# EasyEDA Pro project functional hub.epro, board PCB1
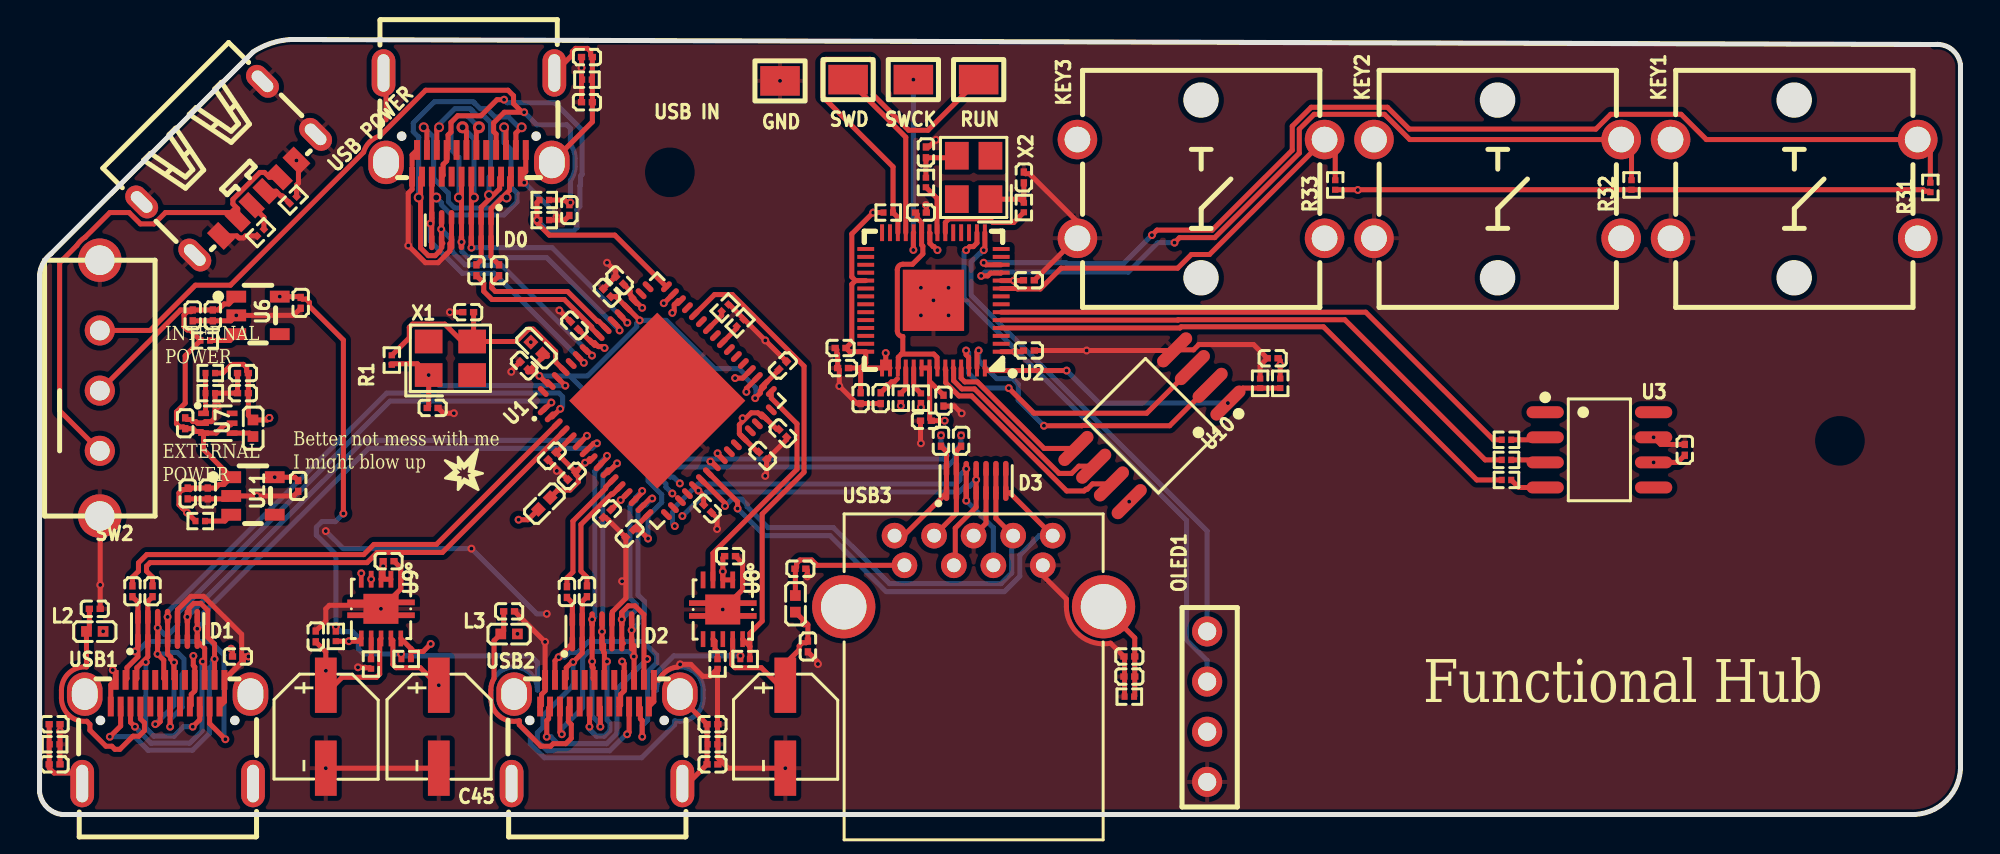
[diagram p1: board, top side]
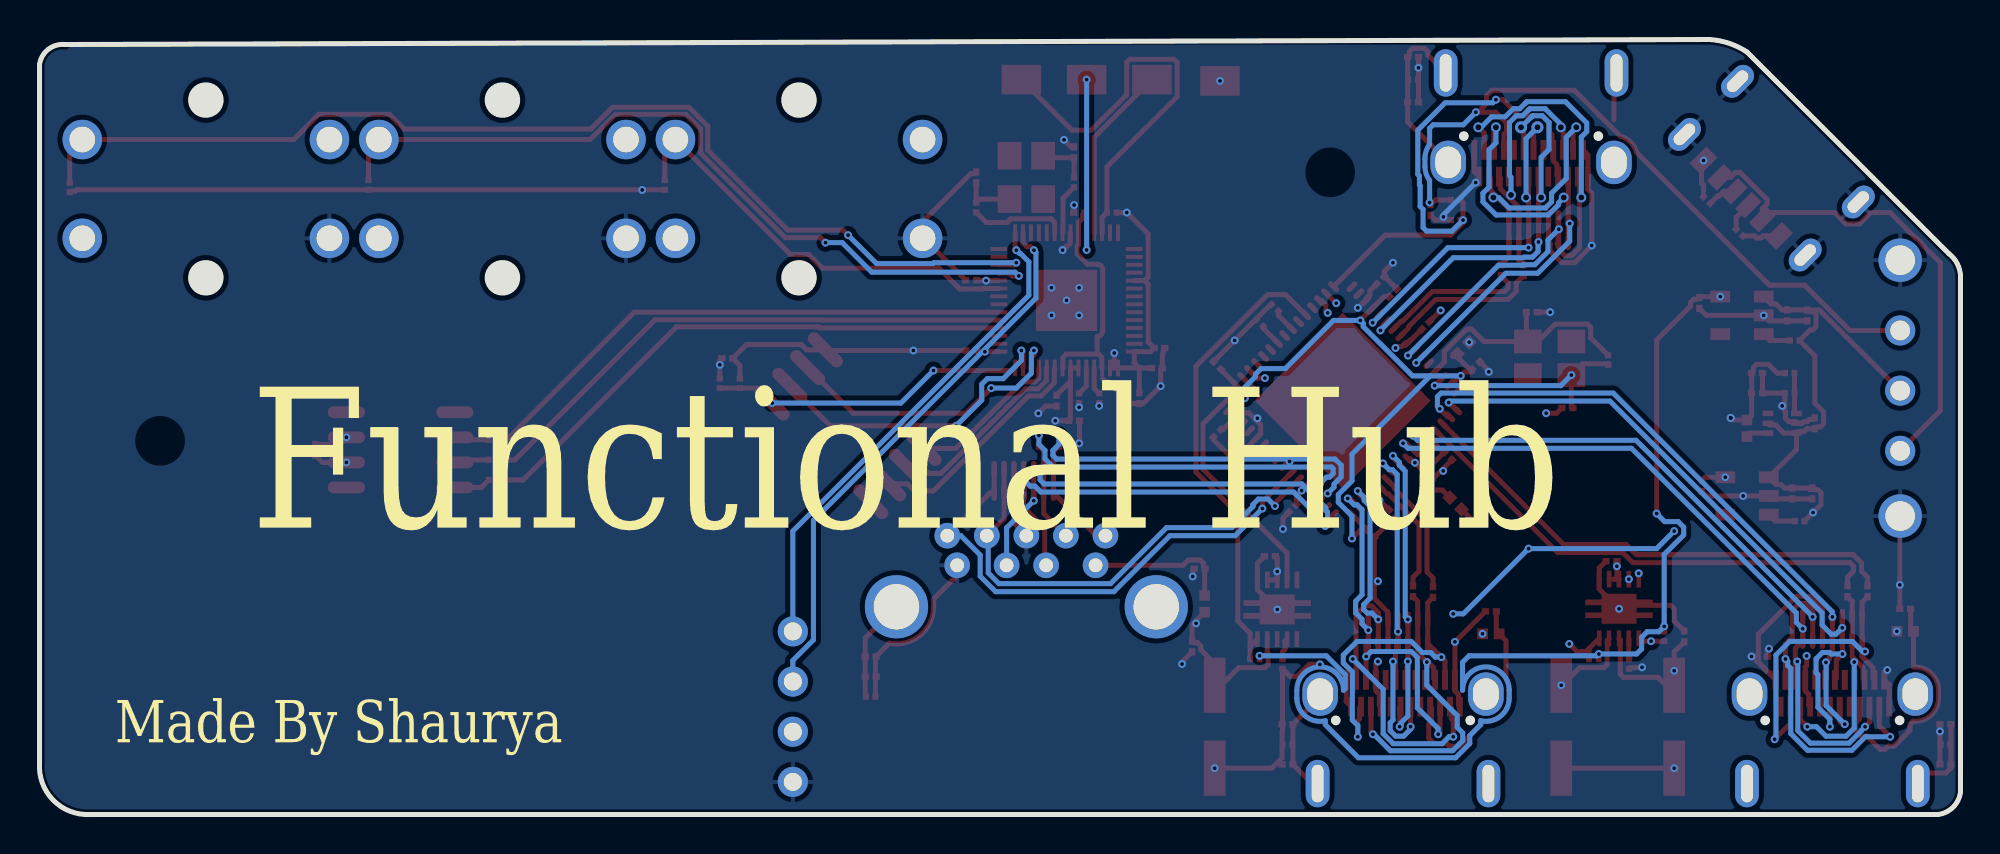
[diagram p2: board, bottom side, seen from below]

Outline 97.15 x 39.24 mm; copper layers: Top Layer, Inner1, Inner2, Bottom Layer. Coordinates in mm from the lower left corner of the outline.
Outline path: 0,27.3 0,1.14 arc(0.37,0.37) 1.14,0 94.61,0 arc(96.46,0.73) 97.15,2.59 97.15,37.97 arc(96.71,38.74) 95.86,38.99 12.7,39.24 arc(11.71,39.05) 10.8,38.61 0.57,28.39 arc(0.17,27.91) 0,27.3
Stack: Top Layer 0.035mm Outer layer thickness 1oz / Dielectric1 0.2104mm 7628 RC49% 8.6mil / Inner1 0.0152mm Inner layer thickness / Dielectric2 1.065mm 1.1mm H/HOZ Copper / Inner2 0.0152mm Inner layer thickness / Dielectric3 0.2104mm 7628 RC49% 8.6mil / Bottom Layer 0.035mm Outer layer thickness 1oz

## Design rules (mm)
net TX0+: DP6
net T0+: DP1
net TX0-: DP6
net T0-: DP1
net TX1+: DP4
net TX1-: DP4
net TX2+: DP5
net TX2-: DP5
net TX3-: DP11
net TX3+: DP11
net D0+: DP2
net D0-: DP2
net RX0+: DP3
net RX0-: DP3
net D1+: DP7
net D1-: DP7
net RX1+: DP8
net RX1-: DP8
net D2+: DP9
net D2-: DP9
net RX2+: DP10
net RX2-: DP10
net D3+: DP12
net D3-: DP12
net RX3+: DP13
net RX3-: DP13
net PI_DP: DP14
net PI_DM: DP14
spacing copperThickness1oz (default): track to track 0.102, other pairs 0.152 to 0.3
spacing copperThickness2oz: track to track 0.203, other pairs 0.152 to 0.3
spacing Plane_innerPlane: track to track 0.102, other pairs 0.152 to 0.3
spacing Copper_copperRegion: track to track 0.102, other pairs 0.152 to 0.3
track width copperThickness1oz (default): min 0.127, default 0.254, max 2.54
track width copperThickness2oz: min 0.203, default 0.254, max 2.54
differential pair differentialPair (default): width min 0.127, default 0.254, max 2.54; gap min 0.152, default 0.152
net GND uses copperRegion_copperThickness1oz
net VBUS1 uses copperRegion_copperThickness1oz
net VBUS2 uses copperRegion_copperThickness1oz
net VBUS3 uses copperRegion_copperThickness1oz
pour e1772 uses Copper_copperRegion, copperRegion_Copper_copperRegion
pour e2090 uses Copper_copperRegion, copperRegion_Copper_copperRegion
pour e2312 uses Copper_copperRegion, copperRegion_Copper_copperRegion
pour e2453 uses Copper_copperRegion, copperRegion_Copper_copperRegion

## Placement (name value [footprint] x y rotation side)
C1  18pf  [C0201]  19.88 20.59 0 top
C2  18pf  [C0201]  21.68 25.44 0 top
C8  0.001uf  [C0201]  34.04 2.54 180 top
C9  0.1uf  [C0201]  34.04 4.57 0 top
C10  0.1uf  [C0201]  26.67 11.26 90 top
C11  0.1uf  [C0201]  27.69 11.3 90 top
C12  0.1uf  [C0201]  23.75 10.29 0 top
C13  0.001uf  [C0201]  27.69 38.35 0 top
C14  0.1uf  [C0201]  27.69 36.07 180 top
C15  0.1uf  [C0201]  23.24 27.56 270 top
C16  0.1uf  [C0201]  22.1 27.56 270 top
C17  100nF  [C0201]  26.8 30.61 270 top
C18  0.1uf  [C0201]  46.61 18.92 90 top
C19  0.1uf  [C0201]  45.59 18.92 90 top
C20  0.001uf  [C0201]  55.12 8 0 top
C21  0.1uf  [C0201]  55.12 6.98 180 top
C22  4.7uf  [C0201]  7.37 19.81 270 top
C23  22uf  [C0201]  10.29 22.35 0 top
C24  22uf  [C0201]  10.29 21.34 180 top
C25  1uf  [C0201]  7.75 25.27 270 top
C26  0.1uf  [C0201]  8.76 25.27 270 top
C27  1uf  [C0201]  13.21 25.91 270 top
C28  0.1uf  [C0201]  37.59 22.73 45 top
C29  0.1uf  [C0201]  24.51 22.73 135 top
C30  0.001uf  [C0201]  0.76 2.54 180 top
C31  0.1uf  [C0201]  28.7 26.42 135 top
C32  10uf  [C0201]  29.84 14.22 225 top
C33  0.1uf  [C0201]  37.59 19.3 315 top
C34  0.1uf  [C0201]  36.58 18.16 315 top
C35  0.1uf  [C0201]  33.78 15.49 315 top
C36  0.1uf  [C0201]  28.7 15.24 225 top
C37  10uf  [C0201]  26.92 17.14 225 top
C38  0.1uf  [C0201]  25.91 18.16 225 top
C39  0.1uf  [C0201]  29.34 27.05 135 top
C40  0.1uf  [C0201]  27.05 24.77 135 top
C41  0.1uf  [C0201]  38.48 12.45 180 top
C42  100nF  [C0201]  17.65 12.83 180 top
C43  100nF  [C0201]  34.92 13.08 180 top
C44  100nF  [C0201]  10.03 8 0 top
C45  150uF  [CAP-SMD_BD5.0-L5.3-W5.3-FD]  20.19 4.44 270 top
C46  100nF  [C0201]  13.97 9.02 90 top
C47  150uF  [CAP-SMD_BD5.0-L5.3-W5.3-FD]  14.48 4.44 270 top
C48  100nF  [C0201]  38.86 8.51 270 top
C49  150uF  [CAP-SMD_BD5.0-L5.3-W5.3-FD]  37.72 4.44 270 top
C50  100nF  [C0201]  62.37 23.1 180 top
C51  100nF  [C0201]  49.78 32.26 90 top
C52  100nF  [C0201]  44.83 33.53 270 top
C53  100nF  [C0201]  50.04 27.05 180 top
C54  100nF  [C0201]  50.04 23.5 180 top
C55  100nF  [C0201]  44.83 19.94 0 top
C56  100nF  [C0201]  45.72 20.95 90 top
C57  100nF  [C0201]  40.64 22.61 0 top
C58  100nF  [C0201]  41.53 21.08 90 top
C59  100nF  [C0201]  44.58 30.48 180 top
C60  100nF  [C0201]  42.55 21.08 90 top
C61  1uf  [C0201]  40.51 23.62 0 top
C62  100nF  [C0201]  83.21 18.46 270 top
C63  1uf  [C0201]  8.51 16.26 270 top
C64  0.1uf  [C0201]  7.49 16.26 270 top
C65  1uf  [C0201]  13.08 16.64 270 top
C66  0.1uf  [C0201]  0.76 4.57 0 top
C67  0.1uf  [C0201]  4.7 11.3 90 top
C68  0.1uf  [C0201]  5.71 11.3 90 top
C69  0.1uf  [C0201]  2.79 10.41 0 top
D0  TPD6E05U06RVZR  [USON-14_L3.5-W1.4-P0.5-BL]  21.34 29.59 180 top
D1  TPD6E05U06RVZR  [USON-14_L3.5-W1.4-P0.5-BL]  6.48 9.4 0 top
D2  TPD6E05U06RVZR  [USON-14_L3.5-W1.4-P0.5-BL]  28.45 9.27 0 top
D3  TPD6E05U06RVZR  [USON-14_L3.5-W1.4-P0.5-BL]  47.37 16.89 0 top
GND  S2761-46R  [TESTPOINT-SMD_L1.6-W0.8_RCU-0C]  37.45 37.15 0 top
KEY1  B3F-4055  [KEY-TH_4P-L12.0-W12.0-P5.00-LS13.4-EH]  88.74 31.68 0 top
KEY2  B3F-4055  [KEY-TH_4P-L12.0-W12.0-P5.00-LS13.4-EH]  73.74 31.68 0 top
KEY3  B3F-4055  [KEY-TH_4P-L12.0-W12.0-P5.00-LS13.4-EH]  58.74 31.68 0 top
L1  1uH  [L0402]  10.8 19.56 90 top
L2  BLM18KG221SN1D  [L0402]  2.79 9.27 0 top
L3  BLM18KG221SN1D  [L0402]  23.75 9.14 0 top
L7  BLM18KG221SN1D  [L0402]  38.23 10.67 90 top
L8  BLM18KG221SN1D  [L0402]  25.53 15.75 45 top
L9  BLM18KG221SN1D  [L0402]  25.15 23.62 315 top
OLED1  OLED 0.91" 128x32  [OLED_0.91_128X32]  56.52 11.81 0 top
R1  1M  [R0201]  17.82 23.01 90 top
R5  4.7K  [R0201]  34.67 25.65 45 top
R6  4.7K  [R0201]  35.43 24.89 45 top
R7  1M  [R0201]  34.04 3.56 0 top
R8  1M  [R0201]  0.76 3.56 0 top
R9  1M  [R0201]  27.69 37.21 180 top
R10  90.9K  [R0201]  25.53 31.11 180 top
R11  10K  [R0201]  25.53 30.1 0 top
R13  1M  [R0201]  55.12 5.97 180 top
R14  83.333k  [R0201]  8.64 22.35 180 top
R15  100k  [R0201]  8.64 21.34 180 top
R16  10K  [R0201]  8.38 24 0 top
R17  25.5K  [R0201]  16.76 7.62 90 top
R18  10K  [R0201]  18.54 7.87 180 top
R19  10K  [R0201]  14.99 9.02 90 top
R20  25.5K  [R0201]  34.29 7.62 90 top
R21  10K  [R0201]  35.69 7.87 180 top
R22  10K  [R0201]  12.83 31.11 45 top
R23  10K  [R0201]  11.18 29.46 45 top
R24  27K  [R0201]  44.58 21.08 270 top
R25  27K  [R0201]  43.56 21.08 270 top
R26  1K  [R0201]  61.73 21.83 270 top
R27  10K  [R0201]  62.75 21.83 90 top
R28  10K  [R0201]  44.83 32 90 top
R29  10K  [R0201]  49.78 30.73 270 top
R30  10K  [R0201]  42.93 30.48 0 top
R31  4.7k  [R0201]  95.63 31.75 90 top
R32  4.7k  [R0201]  80.52 31.88 90 top
R33  4.7k  [R0201]  65.53 31.88 90 top
R34  100  [R0201]  74.19 17.96 0 top
R35  100  [R0201]  74.19 18.97 0 top
R36  470  [R0201]  74.19 16.94 0 top
R37  10K  [R0201]  8.13 14.86 0 top
RUN  S2761-46R  [TESTPOINT-SMD_L1.6-W0.8_RCU-0C]  47.5 37.21 0 top
SW2  SK-12E12-G5  [SW-TH_SK-12E12-G5]  3.05 21.59 180 top
SWCK  S2761-46R  [TESTPOINT-SMD_L1.6-W0.8_RCU-0C]  44.2 37.21 0 top
SWD  S2761-46R  [TESTPOINT-SMD_L1.6-W0.8_RCU-0C]  40.89 37.21 0 top
U1  TUSB8041RGCT  [VQFN-64_L9.0-W9.0-P0.50-TL-EP6.3]  31.24 20.95 45 top
U2  RP2040  [LQFN-56_L7.0-W7.0-P0.4-EP]  45.21 26.03 180 top
U3  TLE5012BE5000XUMA1  [PG-DSO-8_L5.0-W4.0-P1.27-LS6.0-BL]  78.89 18.46 270 top
U6  TLV70033DDCT  [SOT-23-5_L2.9-W1.6-P0.95-LS2.8-BR]  11.05 25.27 180 top
U7  TLV62568PDRLR  [SOT-563_L1.6-W1.2-P0.50-LS1.6-BL]  9.02 19.81 270 top
U8  TPS2561DRCR  [VSON-10_L3.0-W3.0-P0.50-TL-EP_TPS62410DRCR]  34.56 10.38 270 top
U9  TPS2561DRCR  [VSON-10_L3.0-W3.0-P0.50-TL-EP_TPS62410DRCR]  17.27 10.41 270 top
U10  W25Q128JVSIQ  [SOIC-8_L5.3-W5.3-P1.27-LS8.0-BL]  56.26 19.69 135 top
U11  TLV70033DDCT  [SOT-23-5_L2.9-W1.6-P0.95-LS2.8-BR]  10.8 16.13 180 top
USB1  TYPE-C 6P  [USB-C-SMD_TYC-324G]  6.48 4.19 0 top
USB2  TYC-324G  [USB-C-SMD_TYC-324G]  28.19 4.19 0 top
USB3  TYC-324G  [USB-TH_USB3.0-A]  47.24 12.32 0 top
USB IN  TYC-324G  [USB-C-SMD_TYC-324G]  21.72 34.92 180 top
USB POWER  TYPE-C 6P  [TYPE-C-SMD_TYPE-C-6P_1]  9.65 32.64 225 top
X1  24MHz  [CRYSTAL-SMD_4P-L3.2-W2.5-BL]  20.78 23.1 0 top
X2  12MHz  [CRYSTAL-SMD_4P-L3.2-W2.5-BL]  47.24 32.26 90 top

## Footprints (pads in the part's own frame, mm; a bottom-side part is the same pattern mirrored in y, then rotated)
C0201
  rect 0.368x0.324 smd: 1(-0.275,0) 2(0.275,0)
CAP-SMD_BD5.0-L5.3-W5.3-FD
  rect 2.8x1.1 smd: 1(-2.1,0) 2(2.1,0)
CRYSTAL-SMD_4P-L3.2-W2.5-BL
  rect 1.4x1.2 smd: 1(-1.1,-0.85) 2(1.1,-0.85) 3(1.1,0.85) 4(-1.1,0.85)
KEY-TH_4P-L12.0-W12.0-P5.00-LS13.4-EH
  round 2 hole 1.3: 1(6.25,-2.5) 2(-6.25,-2.5) 3(6.25,2.5) 4(-6.25,2.5)
L0402
  rect 0.54x0.54 smd: 1(-0.42,0) 2(0.42,0)
LQFN-56_L7.0-W7.0-P0.4-EP
  rect 0.85x0.2 smd: 1(-3.425,2.6) 2(-3.425,2.2) 3(-3.425,1.8) 4(-3.425,1.4) 5(-3.425,1) 6(-3.425,0.6) 7(-3.425,0.2) 8(-3.425,-0.2) 9(-3.425,-0.6) 10(-3.425,-1) 11(-3.425,-1.4) 12(-3.425,-1.8) 13(-3.425,-2.2) 14(-3.425,-2.6) 29(3.425,-2.6) 30(3.425,-2.2) 31(3.425,-1.8) 32(3.425,-1.4) 33(3.425,-1) 34(3.425,-0.6) 35(3.425,-0.2) 36(3.425,0.2) 37(3.425,0.6) 38(3.425,1) 39(3.425,1.4) 40(3.425,1.8) 41(3.425,2.2) 42(3.425,2.6)
  rect 0.2x0.85 smd: 15(-2.6,-3.425) 16(-2.2,-3.425) 17(-1.8,-3.425) 18(-1.4,-3.425) 19(-1,-3.425) 20(-0.6,-3.425) 21(-0.2,-3.425) 22(0.2,-3.425) 23(0.6,-3.425) 24(1,-3.425) 25(1.4,-3.425) 26(1.8,-3.425) 27(2.2,-3.425) 28(2.6,-3.425) 43(2.6,3.425) 44(2.2,3.425) 45(1.8,3.425) 46(1.4,3.425) 47(1,3.425) 48(0.6,3.425) 49(0.2,3.425) 50(-0.2,3.425) 51(-0.6,3.425) 52(-1,3.425) 53(-1.4,3.425) 54(-1.8,3.425) 55(-2.2,3.425) 56(-2.6,3.425)
  rect 3.1x3.1 smd: 57(0,0)
OLED_0.91_128X32
  round 1.524 hole 0.914: 1(2.54,-2.54) 2(2.54,-5.08) 3(2.54,-7.62) 4(2.54,-10.16)
PG-DSO-8_L5.0-W4.0-P1.27-LS6.0-BL
  oval 0.602x1.885 smd: 1(-1.905,-2.743) 2(-0.635,-2.743) 3(0.635,-2.743) 4(1.905,-2.743) 5(1.905,2.743) 6(0.635,2.743) 7(-0.635,2.743) 8(-1.905,2.743)
R0201
  rect 0.303x0.324 smd: 1(-0.241,0) 2(0.241,0)
SOIC-8_L5.3-W5.3-P1.27-LS8.0-BL
  oval 0.63x2.25 smd: 1(-1.905,-3.53) 2(-0.635,-3.53) 3(0.635,-3.53) 4(1.905,-3.53) 5(1.905,3.53) 6(0.635,3.53) 7(-0.635,3.53) 8(-1.905,3.53)
SOT-23-5_L2.9-W1.6-P0.95-LS2.8-BR
  rect 1x0.6 smd: 1(1.1,-0.95) 2(1.1,0) 3(1.1,0.95) 4(-1.1,0.95) 5(-1.1,-0.95)
SOT-563_L1.6-W1.2-P0.50-LS1.6-BL
  rect 0.28x0.545 smd: 1(-0.5,-0.723) 2(0,-0.723) 3(0.5,-0.723) 4(0.5,0.723) 5(0,0.723) 6(-0.5,0.723)
SW-TH_SK-12E12-G5
  round 1.524 hole 1: 1(0,3.175) 2(0,0.127) 3(0,-2.921)
  round 2.2 hole 1.5: 4(0,-6.477) 5(0,6.477)
TESTPOINT-SMD_L1.6-W0.8_RCU-0C
  rect 2x1.5 smd: 1(0,0)
TYPE-C-SMD_TYPE-C-6P_1
  oval 1.1x1.9 hole 0.6x1.3: 7(-4.32,1.775) 7(-4.32,-2.025) 7(4.32,1.775) 7(4.32,-2.025)
  rect 0.7x1.2 smd: A5(-0.5,2.025) A9(1.5,2.025) B5(0.5,2.025) B9(-1.5,2.025)
  rect 0.8x1.2 smd: A12(2.7,2.025) B12(-2.7,2.025)
USB-C-SMD_TYC-324G
  oval 1.8x2.2 hole 1.3x1.6: 1(-4.191,1.905) 4(4.191,1.905)
  oval 1.2x2.4 hole 0.6x1.9: 2(-4.32,-2.625) 3(4.32,-2.625)
  rect 0.3x1 smd: A1(-2.625,2.625) A2(-2.125,2.625) A3(-1.625,2.625) A4(-1.125,2.625) A5(-0.625,2.625) A6(-0.125,2.625) A7(0.375,2.625) A8(0.875,2.625) A9(1.375,2.625) A10(1.875,2.625) A11(2.375,2.625) A12(2.875,2.625) B1(2.625,1.275) B2(2.125,1.275) B3(1.625,1.275) B4(1.125,1.275) B5(0.625,1.275) B6(0.125,1.275) B7(-0.375,1.275) B8(-0.875,1.275) B9(-1.375,1.275) B10(-1.875,1.275) B11(-2.375,1.275) B12(-2.875,1.275)
USB-TH_USB3.0-A
  round 1.3 hole 0.7: 1(-3.5,0.3) 2(-1,0.3) 3(1,0.3) 4(3.5,0.3) 5(4,1.8) 6(2,1.8) 7(0,1.8) 8(-2,1.8) 9(-4,1.8)
  round 3.2 hole 2.3: 10(-6.57,-1.8) 10(6.57,-1.8)
USON-14_L3.5-W1.4-P0.5-BL
  oval 0.28x0.815 smd: 1(-1.5,-0.608) 2(-1,-0.608) 3(-0.5,-0.608) 4(0,-0.608) 5(0.5,-0.608) 6(1,-0.608) 7(1.5,-0.608) 8(1.5,0.608) 9(1,0.608) 10(0.5,0.608) 11(0,0.608) 12(-0.5,0.608) 13(-1,0.608) 14(-1.5,0.608)
VQFN-64_L9.0-W9.0-P0.50-TL-EP6.3
  oval 0.665x0.28 smd: 1(-4.408,3.75) 2(-4.407,3.25) 3(-4.407,2.75) 4(-4.407,2.25) 5(-4.407,1.75) 6(-4.408,1.25) 7(-4.407,0.75) 8(-4.407,0.25) 9(-4.407,-0.25) 10(-4.407,-0.75) 11(-4.408,-1.25) 12(-4.407,-1.75) 13(-4.407,-2.25) 14(-4.407,-2.75) 15(-4.407,-3.25) 16(-4.408,-3.75) 33(4.408,-3.75) 34(4.407,-3.25) 35(4.407,-2.75) 36(4.407,-2.25) 37(4.407,-1.75) 38(4.408,-1.25) 39(4.407,-0.75) 40(4.407,-0.25) 41(4.407,0.25) 42(4.407,0.75) 43(4.408,1.25) 44(4.407,1.75) 45(4.407,2.25) 46(4.407,2.75) 47(4.407,3.25) 48(4.408,3.75)
  oval 0.28x0.665 smd: 17(-3.75,-4.408) 18(-3.25,-4.407) 19(-2.75,-4.407) 20(-2.25,-4.407) 21(-1.75,-4.407) 22(-1.25,-4.408) 23(-0.75,-4.407) 24(-0.25,-4.407) 25(0.25,-4.407) 26(0.75,-4.407) 27(1.25,-4.408) 28(1.75,-4.407) 29(2.25,-4.407) 30(2.75,-4.407) 31(3.25,-4.407) 32(3.75,-4.408) 49(3.75,4.408) 50(3.25,4.407) 51(2.75,4.407) 52(2.25,4.407) 53(1.75,4.407) 54(1.25,4.408) 55(0.75,4.407) 56(0.25,4.407) 57(-0.25,4.407) 58(-0.75,4.407) 59(-1.25,4.408) 60(-1.75,4.407) 61(-2.25,4.407) 62(-2.75,4.407) 63(-3.25,4.407) 64(-3.75,4.408)
  rect 6.3x6.3 smd: 65(0,0)
VSON-10_L3.0-W3.0-P0.50-TL-EP_TPS62410DRCR
  rect 0.85x0.24 smd: 1(-1.5,1) 2(-1.5,0.5) 3(-1.5,0) 4(-1.5,-0.5) 5(-1.5,-1)
  rect 0.8x0.23 smd: 6(1.5,-1) 7(1.5,-0.5) 8(1.5,0) 9(1.5,0.5) 10(1.5,1)
  custom 1.52x3.42 smd: 11(0,-0.005)

## Nets
1.1V: C23.2 C24.1 C59.2 C60.2 L1.2 L8.1 R14.1 U2.23 U2.45 U2.50
1.1VP: C33.1 C34.1 C35.1 C36.1 C37.1 C38.1 C39.1 C40.1 L8.2 U1.5 U1.8 U1.13 U1.21 U1.28 U1.31 U1.51 U1.57
3.3V: C27.1 L9.1 R18.2 R19.2 R21.2 U6.5
3.3VP: C28.1 C29.1 C31.1 C32.1 L9.2 U1.16 U1.34 U1.52 U1.63
3.3VPI: C50.1 C53.2 C54.2 C55.2 C56.2 C57.2 C58.2 C61.2 C62.2 C65.1 OLED1.3 R27.2 R30.1 R31.1 R32.1 R33.1 U2.1 U2.10 U2.22 U2.33 U2.42 U2.43 U2.44 U2.48 U2.49 U3.6 U10.8 U11.5
5V: C22.2 C25.1 C26.1 C42.2 C43.2 C63.1 C64.1 R16.1 R37.1 SW2.2 U6.1 U7.3 U7.5 U8.2 U8.3 U9.2 U9.3 U11.1
GND: C1.2 C2.1 C8.1 C9.2 C12.2 C13.1 C14.2 C17.2 C20.1 C21.2 C22.1 C23.1 C24.2 C25.2 C26.2 C27.2 C28.2 C29.2 C30.1 C31.2 C32.2 C33.2 C34.2 C35.2 C36.2 C37.2 C38.2 C39.2 C40.2 C41.1 C42.1 C43.1 C44.2 C45.2 C46.2 C47.2 C48.2 C49.2 C50.2 C51.2 C52.1 C53.1 C54.1 C55.1 C56.1 C57.1 C58.1 C59.1 C60.1 C61.1 C62.1 C63.2 C64.2 C65.2 C66.2 C69.2 D0.5 D0.10 D1.5 D1.10 D2.5 D2.10 D3.5 D3.10 GND.1 KEY1.2 KEY2.2 KEY3.2 OLED1.4 R5.2 R6.2 R7.2 R8.2 R9.2 R11.2 R13.2 R15.1 R17.1 R20.1 R22.2 R23.1 R26.1 SW2.4 SW2.5 U1.65 U2.57 U3.7 U6.2 U7.2 U8.1 U8.11 U9.1 U9.11 U10.4 U11.2 USB1.A1 USB1.A12 USB1.B1 USB1.B12 USB2.A1 USB2.A12 USB2.B1 USB2.B12 USB3.4 USB3.7 USB IN.A1 USB IN.A12 USB IN.B1 USB IN.B12 USB POWER.7 USB POWER.A12 USB POWER.B12
VBUS0: R10.2 R11.1 U1.48 USB IN.A4 USB IN.A9 USB IN.B4
VBUS1: C44.1 C45.1 L2.2 U9.9 USB1.A4 USB1.A9 USB1.B4
VBUS2: C46.1 C47.1 L3.2 U9.8 USB2.A4 USB2.A9 USB2.B4
VBUS3: C48.1 C49.1 L7.1 U8.9
CSQ: R34.1 U2.5
D0+: D0.3 D0.12 U1.53 USB IN.A6 USB IN.B6
D0-: D0.4 D0.11 U1.54 USB IN.A7 USB IN.B7
D1+: D1.3 D1.12 U1.1 USB1.A6 USB1.B6
D1-: D1.4 D1.11 U1.2 USB1.A7 USB1.B7
D2+: D2.3 D2.12 U1.9 USB2.A6 USB2.B6
D2-: D2.4 D2.11 U1.10 USB2.A7 USB2.B7
D3+: D3.3 D3.12 U1.17 USB3.3
D3-: D3.4 D3.11 U1.18 USB3.2
DATA: R36.1 U2.4
EXT_POWER: SW2.1 USB POWER.A9 USB POWER.B9
OVER1: R18.1 U1.46 U9.10
OVER2: R19.1 U1.47 U9.6
OVER3: R21.1 U1.44 U8.10
PI_DM: R25.2 U1.25
PI_DP: R24.2 U1.24
PWRCTL1: U1.36 U9.4
PWRCTL2: U1.35 U9.5
PWRCTL3: U1.33 U8.4
PWRCTL4: U1.32
RX0+: D0.6 D0.9 U1.58 USB IN.A11 USB IN.B11
RX0-: D0.7 D0.8 U1.59 USB IN.A10 USB IN.B10
RX1+: D1.6 D1.9 U1.6 USB1.A11 USB1.B11
RX1-: D1.7 D1.8 U1.7 USB1.A10 USB1.B10
RX2+: D2.6 D2.9 U1.14 USB2.A11 USB2.B11
RX2-: D2.7 D2.8 U1.15 USB2.A10 USB2.B10
RX3+: D3.6 D3.9 U1.22 USB3.6
RX3-: D3.7 D3.8 U1.23 USB3.5
SCK: OLED1.2 U2.16
SCKA: R35.1 U2.6
SCLK: U2.52 U10.6
SD0: U2.53 U10.5
SD1: U2.55 U10.2
SD2: U2.54 U10.3
SD3: U2.51 U10.7
SDA: OLED1.1 U2.15
SS: R26.2 R27.1 U2.56 U10.1
SW1: KEY1.3 R31.2 U2.12
SW2: KEY2.3 R32.2 U2.11
SW3: KEY3.3 R33.2 U2.9
T0+: C15.1 D0.1 D0.14 USB IN.A2 USB IN.B2
T0-: C16.1 D0.2 D0.13 USB IN.A3 USB IN.B3
T1+: C67.1 D1.1 D1.14 USB1.A2 USB1.B2
T1-: C68.1 D1.2 D1.13 USB1.A3 USB1.B3
T2+: C10.1 D2.1 D2.14 USB2.A2 USB2.B2
T2-: C11.1 D2.2 D2.13 USB2.A3 USB2.B3
T3+: C19.1 D3.1 D3.14 USB3.9
T3-: C18.1 D3.2 D3.13 USB3.8
TX0+: C15.2 U1.55
TX0-: C16.2 U1.56
TX1+: C67.2 U1.3
TX1-: C68.2 U1.4
TX2+: C10.2 U1.11
TX2-: C11.2 U1.12
TX3+: C19.2 U1.19
TX3-: C18.2 U1.20
UP_POWER: C17.1 R10.1 SW2.3 USB IN.B9
XI: C1.1 R1.1 U1.62 X1.1
XO: C2.2 R1.2 U1.61 X1.3
$1N3195: R5.1 U1.42
$1N3221: R6.1 U1.40
$1N6674: C20.2 C21.1 R13.1 USB3.10
$1N7398: L1.1 U7.4
$1N7474: R14.2 R15.2 U7.1
$1N10571: C41.2 L7.2 USB3.1
$1N11667: R17.2 U9.7
$1N12274: R20.2 U8.7
$1N12991: R22.1 USB POWER.A5
$1N12995: R23.2 USB POWER.B5
$1N13220: R24.1 U2.47
$1N13246: R25.1 U2.46
$1N13961: C51.1 R29.1 X2.1
$1N13963: C52.2 R28.2 X2.3
$1N14103: R28.1 U2.21
$1N14108: R29.2 U2.20
$1N14919: R30.2 RUN.1 U2.26
$1N15444: R34.2 U3.3
$1N15470: R35.2 U3.2
$1N15496: R36.2 U3.4
$1N16095: SWCK.1 U2.24
$1N16100: SWD.1 U2.25
$1N22955: R16.2 U6.3
$1N22971: R37.2 U11.3
$1N23089: C30.2 C66.1 R8.1 USB1.1 USB1.2 USB1.3 USB1.4
$1N23092: C69.1 L2.1 USB1.B9
$1N23137: C8.2 C9.1 R7.1 USB2.1 USB2.2 USB2.3 USB2.4
$1N23140: C12.1 L3.1 USB2.B9
$1N23189: C13.2 C14.1 R9.1 USB IN.1 USB IN.2 USB IN.3 USB IN.4

Pads without a net: KEY1 1 4; KEY2 1 4; KEY3 1 4; U1 26 27 29 30 37 38 39 41 43 45 49 50 60 64; U2 2 3 7 8 13 14 17 18 19 27 28 29 30 31 32 34 35 36 37 38 39 40 41; U3 1 5 8; U6 4; U7 6; U8 5 6 8; U11 4; USB1 A5 A8 B5 B8; USB2 A5 A8 B5 B8; USB IN A5 A8 B5 B8; X1 2 4; X2 2 4

## Via types
v1: diameter 0.4, hole 0.2, Top Layer to Bottom Layer, 180 vias
v2: diameter 0.5, hole 0.305, Top Layer to Bottom Layer, 9 vias
v3: diameter 0.5, hole 0.3, Top Layer to Bottom Layer, 1 via
v4: diameter 0.61, hole 0.305, Top Layer to Bottom Layer, 2 vias

## Routing (per net, layer and track width the routed paths; a pad name or vN(x,y) marks a point on that pad's centre or on a via; arc(x,y) is an arc through that point)
1.1V: length 74.9
  Top Layer w0.254: v1(11.62,20.08) 11.52,19.98 L1.2 10.56,20.21 C24.1 C23.2 10.48,22.44 10.48,22.63 10.31,22.79 9.71,22.79 9.27,22.35 R14.1 ; U2.45 43.43,22.63 43.43,23.15 43.6,23.31 ; 43.6,23.31 45.23,23.31 45.39,23.15 45.39,22.63 U2.50 ; 43.6,23.31 43.66,23.38 43.66,24.21 arc(43.46,24.29) 43.38,24.48 43.38,27.58 arc(43.46,27.78) 43.66,27.86 44.15,27.86 44.67,28.39 44.67,28.78 44.61,28.85 U2.23 44.61,29.98 44.39,30.2 44.39,30.39 C59.2 ; v1(24.23,14.93) 24.7,14.93 L8.1 ; 43.39,22.07 43.23,21.91 43.09,21.91 v1(42.89,21.7) C60.2
  Inner2 w0.254: 16.78,14.93 v1(11.62,20.08) ; 16.78,14.93 v1(24.23,14.93) ; 16.78,14.93 15.17,13.32 15.17,8.58 15.45,8.3 19.44,8.3 19.58,8.16 19.98,8.16 26.23,14.41 31.65,14.41 31.93,14.13 35.31,14.13 v1(42.89,21.7)
1.1VP: length 40.1
  Top Layer w0.254: 30.07,26.13 29.87,26.33 29.87,26.52 29.53,26.86 ; 26.89,19.08 26.17,18.36 C38.1 C37.1 v1(27.59,17.81) 27.63,17.81 27.83,18.02 U1.8 ; U1.21 v1(33.32,16.4) 33.59,16.13 C35.1 ; v1(30.48,25.65) 30.12,26.02 U1.51 ; v1(28.58,23.62) 28.5,23.69 28.27,23.69 28.06,23.89 U1.57 27.92,23.89 C40.1 ; 28.9,15.43 28.9,15.43 v1(29.39,15.92) U1.13 ; C34.1 36.32,18.36 35.39,19.28 35.39,19.74 35.99,20.34 36.34,20.34 36.54,20.14 U1.31 37.3,19.5 37.4,19.5 ; L8.2 26.21,16.43 26.83,16.43 27.25,16.85 27.25,17.08 27.12,17.22
  Inner2 w0.254: v1(27.59,17.81) 27.59,17.72 v1(29.39,15.92) 30.26,15.92 30.28,15.9 30.41,15.9 30.79,15.52 31.55,15.52 31.81,15.78 32.7,15.78 v1(33.32,16.4) 35.56,18.64 v1(35.56,20.07) 35.56,20.57 32.48,23.65 32.48,25.66 31.77,26.37 31.37,26.37 30.66,25.65 v1(30.48,25.65) 30.21,25.38 29.53,25.38 28.86,24.71 28.86,23.91 v1(28.58,23.62)
3.3V: length 74.2
  Top Layer w0.254: v1(15.37,15.24) 15.37,24.02 13.65,25.74 13.65,25.93 13.49,26.1 13.29,26.1 C27.1 ; v1(12.15,26.22) 13.08,26.22
  Inner2 w0.254: v1(12.15,26.22) 22.55,26.22 v1(24.85,23.92)
  Bottom Layer w0.254: v1(15.37,15.24) 14.96,14.83 14.28,14.83 14,14.55 14,14.15 14.99,13.17 v1(14.99,9.53) 15.26,9.25 15.85,9.25 16.13,8.97 16.13,8.39 16.38,8.13 v1(18.29,8.13) 18.38,8.04 24.85,8.04 25.18,7.71 25.18,6.3 arc(24,7.47) 22.82,6.3 22.82,5.9 arc(23.27,4.97) 24.27,4.75 24.27,4.55 24.82,3.99 24.82,3.59 25.54,2.87 30.45,2.87 32.12,4.55 32.12,4.75 arc(33.12,4.97) 33.56,5.9 33.56,6.3 arc(32.39,7.47) 31.21,6.3 31.11,6.39 31.11,7.07 32.08,8.04 v1(35.45,8.04)
3.3VP: length 33.3
  Top Layer w0.254: v1(30.35,25.02) 30.35,25.03 U1.52 29.16,26.22 C31.1 ; 25.7,23.2 25.48,23.2 24.7,22.41 25.07,22.41 v1(25.27,22.21) 25.71,21.77 U1.63 ; C28.1 37.4,22.52 U1.34 36.66,21.66 36.45,21.46 36.45,21.34 v1(36.2,21.08) ; v1(30.78,13.97) 30.33,14.42 30.04,14.42 30.04,14.45 U1.16
  Bottom Layer w0.254: v1(36.2,21.08) 36.2,21.17 36.23,21.2 36.23,21.6 35.66,22.17 35.66,22.3 35.38,22.58 34.15,22.58 31.71,25.02 v1(30.35,25.02) 30.21,24.87 30.21,24.7 27.71,22.21 26.81,22.21 ; v1(30.78,13.97) 30.78,15.11 31.47,15.8 31.47,16.2 30.78,16.89 30.78,18.25 26.81,22.21 ; 26.81,22.21 v1(25.27,22.21)
3.3VPI: length 98
  Top Layer w0.254: U2.22 45.03,29.44 45.03,28.92 45.2,28.76 45.24,28.76 v1(45.41,28.58) ; U2.48 U2.49 45.01,21.94 ; 41.53,22.61 41.49,22.61 ; 41.53,22.61 41.53,22.57 ; 41.53,22.61 41.79,22.87 U2.42 40.97,23.44 C61.2 41.08,23.92 41.08,26.85 41.27,27.03 ; 41.53,22.61 U2.43 ; 41.49,22.61 41.53,22.57 ; 41.49,22.61 40.92,22.61 C57.2 ; R33.1 R32.1 95.28,31.64 95.35,31.56 95.58,31.56 R31.1 ; 45.01,21.94 45.01,21.6 45.02,21.59 45.02,20.02 C55.2 v1(45.78,19.94) ; 45.01,21.94 C56.2 ; 41.27,27.03 U2.33 ; 41.27,27.03 41.25,27.03 ; 41.53,22.57 C58.2 ; C53.2 49.75,27.03 v1(49.28,27.03) U2.10 ; C50.1 62.75,23 v1(62.75,22.77) R27.2 ; U2.43 42.8,22.8 v1(42.8,23.37) ; U2.43 U2.44 ; 41.25,27.06 41.08,27.22 41.08,29.4 v1(42.16,30.48) R30.1 ; v1(11.89,17.08) 12.91,17.08 C65.1 ; C54.2 49.7,23.44 v1(49.34,23.44) U2.1 ; v1(81.64,17.83) 82.85,17.83 C62.2
  Inner2 w0.254: 41.15,33.91 33.96,26.73 30.37,26.73 25.03,21.39 11.36,21.39 11.18,21.21 11.18,21.2 11.14,21.17 11.14,19.88 11.89,19.13 v1(11.89,17.08) ; v1(42.8,23.37) 43.69,23.37 43.81,23.5
  vias: v1(55.11,15.84) v1(66.67,31.62)
5V: length 65
  Top Layer w0.254: C43.2 34.56,12.99 v1(34.56,12.31) U8.3 35.06,11.88 ; U7.3 8.93,19.31 9.35,19.73 9.66,19.73 U7.5 ; U7.3 8.29,18.48 9.69,17.08 9.32,16.71 9.08,16.71 8.9,16.53 C63.1 C64.1 ; U7.3 8.21,19.39 7.91,19.39 7.76,19.54 C22.2 7.28,19.62 7.09,19.62 6.92,19.79 6.92,20.39 7.37,20.83 7.37,23.23 R16.1 7.61,24.54 7.47,24.54 7.31,24.7 7.31,25.3 7.47,25.46 7.66,25.46 C25.1 ; SW2.2 7.13,25.55 C25.1 ; R37.1 v1(7.46,15.29) 7.23,15.52 7.22,15.52 7.05,15.68 7.05,16.28 7.22,16.44 7.3,16.44 7.31,16.46 7.61,16.46 7.62,16.44 ; C42.2 v1(17.38,12.57) 17.38,12.02 U9.3 U9.2 ; U6.1 9.58,25.85 9.33,25.85 9.03,25.55 C26.1 C25.1
  Inner2 w0.254: v1(14.48,14.35) 8.39,14.35 v1(7.46,15.29) ; 34.54,12.32 32.39,10.16 29.84,10.16 29.65,10.36 27.75,10.36 27.55,10.16 v1(25.65,10.16) ; v1(17.38,12.57) 20.95,12.57 v1(21.84,13.46)
  Bottom Layer w0.254: v1(14.48,14.35) 15.37,13.46 v1(21.84,13.46) 25.15,10.16 v1(25.65,10.16)
GND: length 157.7
  Top Layer w0.254: 24.32,22.93 23.86,22.47 v1(23.86,22.42) ; C56.1 46.27,20.68 v1(46.64,20.31) ; R17.1 16.71,7.43 16.49,7.43 16.46,7.45 v1(16.11,7.45) ; C69.2 v1(3.07,11.63) 3.07,15.09 SW2.5 ; C45.2 v1(14.48,2.34) ; R22.2 13,31.88 13.1,31.98 13.1,33.01 v1(12.99,33.12) ; C59.1 44.85,30.84 v1(44.83,30.86) ; C53.1 52.44,29.18 KEY3.2 52.49,30.01 50.06,32.45 49.87,32.45 C51.2 ; USB IN.A1 24.59,32.55 USB IN.B12 ; C44.2 10.31,7.77 USB1.A12 ; R23.1 11,29.3 10.42,29.3 10.32,29.2 10.08,29.2 9.98,29.3 USB POWER.A12 ; USB IN.B1 18.84,33.4 18.84,32.88 ; C36.2 28.63,15.05 28.76,14.91 28.77,14.91 C32.2 29.65,10.94 28.97,10.26 28.97,9.9 D2.10 D2.5 ; C60.1 C58.1 41.34,20.81 v1(40.45,21.69) 40.45,22.52 C57.1 40.37,23.3 40.32,23.34 40.32,23.54 C61.1 ; C37.2 C38.2 ; v1(45.34,34.16) 44.98,33.8 C52.1 ; v1(20.95,20.32) 20.42,20.32 C1.2 ; C23.1 C24.2 R15.1 8.88,20.39 8.85,20.36 8.85,20.06 8.68,19.89 8.38,19.89 U7.2 7.99,19.81 7.91,19.89 7.75,19.89 7.64,20 7.45,20 C22.1 ; D1.5 D1.10 6.98,10.37 7.66,11.05 8.3,11.05 10.22,9.12 10.22,7.72 9.35,6.85 USB1.A12 ; C30.1 v1(1.04,4.21) C66.2 ; 28.51,26.61 C39.2 29.14,27.5 v1(28.7,27.94) ; C48.2 39.37,7.73 v1(39.37,7.62) ; C27.2 12.85,25.27 v1(9.95,25.27) 9.67,25 C26.2 C25.2 ; R13.2 54.88,7.97 C20.1 54.17,8.67 arc(52.62,9.07) 51.93,10.52 51.93,10.91 50.74,12.1 USB3.4 ; USB1.A12 9.35,5.72 9.1,5.47 ; 3.6,5.47 3.6,6.57 USB1.A1 ; C41.1 38.83,12.37 v1(38.83,12.06) ; C13.1 v1(27.41,37.81) C14.2 ; 83.21,18.74 82,18.74 v1(81.64,19.1) ; D0.5 D0.10 20.75,28.9 20.75,28.54 20.61,28.4 20.61,28.39 20.16,27.94 19.52,27.94 v1(18.65,28.81) 18.65,31.46 18.84,31.66 USB IN.A12 ; v1(36.7,17.14) 36.77,17.21 C34.2 37.79,18.98 C33.2 ; 30.82,5.47 31.07,5.72 USB2.A12 31.33,6.82 arc(31.71,7.26) 32.27,7.47 v1(32.4,7.6) 32.94,7.6 33.55,7 33.91,7 R20.1 34.29,4.21 34.31,4.19 34.31,2.87 34.83,2.34 v1(37.72,2.34) ; R11.2 26.56,30.1 C17.2 ; D3.10 D3.5 47.87,14.75 USB3.7 ; R26.1 61.73,22.74 C50.2 61.4,23.8 58.64,23.8 58.37,23.53 U10.4 57.38,23.5 v1(52.96,23.5) C54.1 ; 25.32,5.47 25.39,5.54 25.39,6.08 25.57,6.26 USB2.A1 v1(25.57,8.74) C12.2 ; v1(26.29,25.53) 26.86,24.96 ; C64.2 C63.2 9.55,15.98 9.69,16.13 v1(10.99,16.13) 12.85,16.13 C65.2 ; v1(34.27,14.46) 34.27,15.01 33.98,15.3 ; v1(44.58,18.8) 44.56,18.82 C55.1 ; v1(34.55,10.38) 35.56,11.39 U8.1 35.56,12.72 C43.1 ; C42.1 18.27,12.48 U9.1 18.27,11.42 v1(17.27,10.41) 17.09,10.59 14.66,10.59 14.48,10.41 14.48,9.8 C46.2 ; C2.1 v1(20.75,25.44) ; R5.2 34.89,25.83 v1(36.71,24.01) C28.2
  Bottom Layer w0.254: v1(24.52,32) 26.15,30.37 v1(26.15,30.26)
  vias: v1(3.7,7.32) v1(9.02,20.69) v1(10.57,8) v1(26.16,17.4) v1(29.46,11.81) v1(37.45,37.15) v1(44.58,26.67) v1(44.58,25.27) v1(45.21,26.03) v1(45.97,26.67) v1(45.97,25.27)
VBUS0: length 27.2
  Top Layer w0.254: R10.2 25.16,30.99 v1(25.16,30.1) 25.16,29.96 25.78,29.34 29.09,29.34 U1.48 ; v1(23.49,36.19) 23.14,36.19 22.32,35.38 21.15,35.38 20.81,35.04 20.81,34.56 20.66,34.41 20.66,33.72 USB IN.B4 20.59,33.09 20.41,32.92 20.41,32.37 USB IN.A9
  Bottom Layer w0.254: v1(23.49,36.19) 23.65,36.04 26.06,36.04 27.44,34.66 27.44,32.41 27.36,32.33 27.36,31.88 27.33,31.84 27.33,30.79 27.18,30.64 27.18,29.72 27,29.54 25.72,29.54 v1(25.16,30.1)
VBUS1: length 28.3
  Top Layer w0.254: 7.6,5.47 7.67,5.54 7.67,6.08 7.85,6.26 USB1.A9 7.85,7.47 7.78,7.55 7.78,8.03 v1(7.78,8.03) ; v1(9.69,8.4) 9.76,8.32 C44.1 ; U9.9 17.87,8.82 17.87,7.6 18.03,7.43 19.25,7.43 20.14,6.55 v1(20.19,6.55)
  Inner2 w0.254: 9.98,7.25 9.98,8.11 v1(9.69,8.4) ; 9.98,7.25 arc(11.09,7.4) 11.82,6.55 v1(20.19,6.55) ; 9.98,7.25 arc(9.68,6.94) 9.52,6.55 8.78,6.55 7.78,7.55 ; v1(3.22,9.27) 4.35,8.15 4.35,8.06 5.18,7.22 7,7.22 7.32,7.55 7.78,7.55 ; v1(7.78,8.03) 7.78,7.95 7.78,7.95 7.78,7.55
VBUS2: length 26
  Top Layer w0.254: U9.8 17.2,8.85 17.2,7.11 17.04,6.95 15.31,6.95 14.9,6.55 C47.1 14.48,8.23 C46.1 ; v1(29.46,7.75) 29.57,7.64 USB2.A9 29.57,6.26 29.39,6.08 29.39,5.54 29.32,5.47
  Inner2 w0.254: v1(14.48,7.28) 22.3,7.28 v1(24.17,9.15) 24.87,8.45 28.68,8.45 29.38,7.75 v1(29.46,7.75)
VBUS3: length 9
  Top Layer w0.254: 38.23,10.25 38.86,9.61 C48.1 38.78,8.7 38.58,8.7 38.42,8.53 38.42,8.34 37.72,7.64 C49.1 37.39,6.55 36.51,7.43 35.18,7.43 35.02,7.6 35.02,8.15 35.06,8.2 35.06,8.88
  vias: v1(38.66,9.68)
CSQ: length 28.3
  Top Layer w0.254: R34.1 73.12,17.96 66.02,25.05 57.59,25.05 57.57,25.03 U2.5
D0+: length 18.4
  Top Layer w0.254: v1(29.73,24.9) 29.36,25.27 U1.53 ; USB IN.A6 21.84,28.99 D0.12 ; USB IN.B6 21.59,34.6 v4(21.39,34.8)
  Bottom Layer w0.254: v4(21.39,34.8) 21.97,34.22 v3(21.97,31.24) ; v1(29.73,24.9) 25.93,28.7 v1(21.84,28.7)
D0-: length 21
  Top Layer w0.254: D0.11 v1(21.34,28.99) USB IN.A7 ; v4(22.22,34.8) 22.09,34.66 USB IN.B7 ; U1.54 29.25,24.72 29.25,24.7 29.34,24.61 v1(29.34,24.51)
  Bottom Layer w0.254: v1(29.34,24.51) 25.65,28.19 22.1,28.19 22.07,28.22 21.65,28.22 21.36,28.5 21.36,28.97 v1(21.34,28.99) ; v2(21.21,31.24) 21.21,33.27 20.81,33.67 20.81,35.04 21.15,35.38 21.64,35.38 21.71,35.31 21.71,35.31 v4(22.22,34.8)
D1+: length 35.5
  Top Layer w0.254: 25.47,20.49 25.52,20.49 v1(25.89,20.86) ; USB1.A6 6.28,6.89 6.28,7.82 v1(5.97,8.13) 5.97,8.78 D1.3 v1(5.98,9.45) D1.12 ; 6.6,5.47 6.6,5.46 v1(6.6,4.44)
  Bottom Layer w0.254: v1(5.97,8.13) 6.55,8.13 6.62,8.2 6.98,8.2 7.3,7.88 7.3,7.17 7.21,7.08 7.21,5.43 6.6,4.82 v1(6.6,4.44) ; v1(25.89,20.86) 25.81,20.93 17.73,20.93 7,10.2 7,9.59 6.54,9.13 6.3,9.13 v1(5.98,9.45)
D1-: length 34.1
  Top Layer w0.254: 5.97,4.58 6.1,4.7 6.1,5.47 ; v1(6.48,10.01) D1.4 6.48,8.12 6.64,7.96 6.64,7.87 6.8,7.71 6.8,6.87 USB1.A7 ; v1(26.34,20.54) 25.93,20.14 U1.2
  Bottom Layer w0.254: v1(5.85,4.58) 6.8,5.52 6.8,7.71 ; v1(6.48,10.01) 6.48,10.26 17.56,21.34 26.27,21.34 26.45,21.16 26.45,20.66 v1(26.34,20.54)
  vias: v1(6.8,7.7)
D2+: length 16.9
  Top Layer w0.254: v1(27.95,9.88) D2.3 v1(27.95,7.75) 27.95,7.48 28,7.43 28,6.89 USB2.A6 ; 28.32,5.47 28.36,5.42 v1(28.36,4.44) ; v1(28.7,18.16) 28.7,18.06 U1.9
  Bottom Layer w0.254: v1(27.95,9.88) 28.08,10.01 28.08,17.38 28.38,17.68 28.38,17.84 v1(28.7,18.16) ; v1(28.36,4.44) 28.29,4.52 28.29,4.64 27.95,4.99 v1(27.95,7.75)
D2-: length 18.8
  Top Layer w0.254: USB2.A7 28.57,8.18 28.53,8.22 28.53,8.58 D2.4 v1(28.45,9.26) D2.11 ; v1(29.21,17.78) 28.74,17.31 U1.10 ; v1(27.81,4.44) 27.82,4.45 27.82,5.47
  Bottom Layer w0.254: v1(29.21,17.78) 28.89,17.46 28.73,17.46 28.49,17.22 28.49,9.3 v1(28.45,9.26) ; v1(28.7,7.75) 28.7,4.79 28.84,4.64 28.84,4.25 28.56,3.97 28.17,3.97 27.81,4.32 v1(27.81,4.44)
D3+: length 21.8
  Top Layer w0.254: D3.3 v1(46.87,17.5)
  Bottom Layer w0.254: v1(32.13,14.61) 32.01,14.72 32.01,15.31 32.11,15.41 32.11,15.54 33.31,16.73 46.34,16.73 46.55,16.94 46.55,17.18 v1(46.87,17.5) ; v1(46.87,15.89) 48.24,14.52 USB3.3
D3-: length 21
  Top Layer w0.254: D3.11 v1(47.37,16.95) D3.4 47.37,15.56 46.31,14.5 46.31,12.69 USB3.2
  Bottom Layer w0.254: v1(32.51,15.11) 33.73,16.33 46.51,16.33 46.81,16.63 47.05,16.63 v1(47.37,16.95)
DATA: length 28.6
  Top Layer w0.254: U2.4 57.68,24.64 57.74,24.69 64.94,24.69 72.7,16.94 R36.1
EXT_POWER: length 25.2
  Top Layer w0.254: SW2.1 1.02,20.45 1.02,27.94 1.89,28.81 arc(2.07,29.04) 2.3,29.23 3.56,30.48 4.53,30.48 5.1,29.9 5.79,29.9 6.37,30.48 9.69,30.48 10.02,30.15 10.02,30.67 9.78,30.91 9.78,31.15 11.14,32.51 11.38,32.51 11.62,32.27 12.14,32.27
OVER1: length 25.4
  Top Layer w0.254: v1(32,25.4) 32.1,25.49 32.1,25.81 32.3,26.02 U1.46 ; 18.78,8.4 18.93,8.25 19.4,8.25 v1(19.78,8.64) ; 18.78,8.4 U9.10 ; 18.78,8.4 R18.1
  Inner2 w0.254: v1(32,25.4) 31.62,25.4 26.81,20.59 26.81,15.67 v1(19.78,8.64)
OVER2: length 28.9
  Top Layer w0.254: U1.47 31.58,25.89 v1(31.57,25.89) ; U9.6 16.13,8.78 v1(15.65,8.78) R19.1
  Inner2 w0.254: v1(15.65,8.78) 19.24,8.78 25.41,14.94 25.41,21.06 25.69,21.34 26.08,21.34 26.4,21.02 26.74,21.02 31.57,25.85 v1(31.57,25.89)
OVER3: length 24
  Top Layer w0.254: 35.93,8.51 U8.10 ; 35.93,8.51 R21.1 ; 35.93,8.51 35.93,9.17 36.55,9.79 36.55,15.22 38.67,17.33 38.67,22.7 35.04,26.33 34.14,26.33 U1.44
PI_DM: length 11.9
  Inner1 w0.254: v1(43.56,20.69) 43.56,20.23 43.87,19.93 43.87,19.61 43.69,19.43 36.84,19.43 35.07,17.66 34.82,17.66 34.61,17.87 34.61,17.97 v1(34.29,18.29)
PI_DP: length 12.8
  Inner1 w0.254: v1(33.93,17.88) 34.25,17.55 34.35,17.55 34.65,17.26 35.24,17.26 37,19.02 43.85,19.02 44.27,19.44 44.27,19.86 44.58,20.16 v1(44.58,20.62)
PWRCTL1: length 24.3
  Top Layer w0.254: U1.36 35.57,22.1 v1(35.18,22.1)
  Inner1 w0.254: v1(35.18,22.1) 35.18,21.59 30.45,16.86 30.28,16.86 29.87,16.45 29.87,15.72 29.59,15.44 29.03,15.44 25.5,11.91 v1(16.77,11.91)
PWRCTL2: length 25.9
  Top Layer w0.254: v1(35.75,21.4) 35.75,21.57 36.3,22.13
  Inner1 w0.254: v1(35.75,21.4) 31.47,17.12 31.47,15.8 27.1,11.44 16.57,11.44 16.29,11.72 16.29,12.19 v1(16.27,12.21)
PWRCTL3: length 11.8
  Top Layer w0.254: 34.06,11.88 34.06,13.23 38.31,17.48 38.31,19.78 37.01,21.08 37.01,21.42
RX0+: length 29
  Top Layer w0.254: 27.59,23.54 27.64,23.54 v1(27.94,23.24) ; v2(24.38,34.8) 24.09,34.51 USB IN.B11 ; 20.25,28.54 20.01,28.3 19.66,28.3 19.27,28.69 19.27,32.23 USB IN.A11 ; 20.33,28.92 20.33,30.19 D0.6 ; D0.9 20.4,28.92
  Bottom Layer w0.254: v2(19.18,31.24) 19.18,34.3 18.9,34.58 18.9,35.02 19.98,36.09 21.93,36.09 22,36.02 22.01,36.02 22.29,35.74 22.61,35.74 23.03,35.33 23.71,35.33 24.24,34.8 v2(24.38,34.8) ; v1(20.31,29.64) 20.86,29.09 20.86,28.5 21.53,27.84 22.11,27.84 22.14,27.81 23.37,27.81 v1(27.94,23.24)
RX0-: length 25
  Top Layer w0.254: U1.59 27.24,23.16 v1(27.53,22.87) ; v2(23.49,34.8) 23.59,34.7 USB IN.B10 ; USB IN.A10 19.84,32.29 D0.7 19.84,30 v1(19.77,29.92) 19.77,29.91 19.84,29.84 D0.8
  Bottom Layer w0.254: v2(23.49,34.8) 23.49,34.01 23.84,33.66 23.84,31.77 24.15,31.46 24.15,31.02 23.48,30.36 20.84,30.36 20.32,30.88 20.32,30.98 v2(20.07,31.24) ; v1(19.77,29.92) 19.77,29.03 21.38,27.41 22.99,27.41 v1(27.53,22.87)
RX1+: length 42.5
  Top Layer w0.254: v1(27.69,19.18) 27.69,19.17 U1.6 ; USB1.A11 v1(8.85,7.87) 8.85,8.63 8.51,8.97 8.51,10.33 8.15,10.69 7.8,10.69 7.56,10.45 7.56,10.09 v1(7.48,10.01) D1.6 ; 4.1,5.47 4.1,4.48 v1(3.56,3.94)
  Bottom Layer w0.254: v1(8.85,7.87) 8.73,7.76 8.73,7.55 8.58,7.4 8.58,4.1 7.74,3.25 5.49,3.25 4.81,3.94 v1(3.56,3.94) ; v1(27.69,19.18) 27.46,18.95 16.41,18.95 7.48,10.02 v1(7.48,10.01)
RX1-: length 37.2
  Top Layer w0.254: D1.8 v1(7.98,9.41) D1.7 8.35,8.42 USB1.A10 ; v1(4.83,4.44) 4.6,4.67 4.6,5.47 ; 27.59,18.37 28.02,18.8 v1(28.19,18.8)
  Bottom Layer w0.254: v1(7.98,9.41) 8.3,9.73 8.3,10.2 16.64,18.54 27.94,18.54 v1(28.19,18.8) ; v1(8.25,7.75) 8.23,7.72 8.23,4.25 7.59,3.61 5.64,3.61 5.02,4.23 5.02,4.25 v1(4.83,4.44)
RX2+: length 24.3
  Top Layer w0.254: 25.82,5.47 25.75,5.39 25.75,4.85 25.65,4.76 v1(25.65,3.94) ; 29.53,8.66 D2.6 v1(29.45,9.88) 29.45,10.24 29.77,10.56 30.12,10.56 30.57,10.12 USB2.A11 ; U1.14 30.48,16.3 v1(30.48,16.38)
  Bottom Layer w0.254: v1(30.73,7.87) 29.2,6.34 29.2,4.1 28.69,3.58 26.22,3.58 25.87,3.94 v1(25.65,3.94) ; v1(30.48,16.38) 30.16,16.06 30.16,15.91 29.86,15.61 29.86,10.96 30.18,10.63 30.18,10.38 30,10.2 29.77,10.2 v1(29.45,9.88)
RX2-: length 19.9
  Top Layer w0.254: USB2.A10 30.07,8.54 D2.7 v1(29.95,9.34) D2.8 ; v1(26.42,4.06) 26.32,4.16 26.32,5.47 ; v1(30.99,16) 30.89,16 U1.15
  Bottom Layer w0.254: v1(30.99,16) 30.67,15.68 30.51,15.68 30.27,15.44 30.27,11.12 30.59,10.8 30.59,10.21 30.27,9.89 30.27,9.66 v1(29.95,9.34) ; v1(30.06,8) 29.8,8.25 27.77,8.25 27.47,7.95 27.47,5.4 26.42,4.35 v1(26.42,4.06)
RX3+: length 24.2
  Top Layer w0.254: U1.22 34.67,15.76 v1(34.67,15.62) ; USB3.6 48.37,14.99 D3.6 D3.9
  Bottom Layer w0.254: USB3.6 49.17,14.05 49.17,12.23 48.63,11.69 42.99,11.69 40.15,14.53 36.85,14.53 35.78,15.59 35.78,15.69 35.5,15.97 35.02,15.97 v1(34.67,15.62)
RX3-: length 26.4
  Top Layer w0.254: D3.8 D3.7 49.08,16.28 USB3.5 ; v1(35.31,15.49) 35.31,15.83 U1.23
  Bottom Layer w0.254: v1(35.31,15.49) 36.68,14.12 39.98,14.12 42.82,11.28 48.8,11.28 49.58,12.07 49.58,13.14 50.56,14.12 USB3.5
SCK: length 28.2
  Top Layer w0.254: U2.16 47.41,28.94 47.23,28.76 47.04,28.76 v1(46.86,28.58)
  Bottom Layer w0.254: v1(46.86,28.58) 46.76,28.47 46.76,26.14 58.01,14.89 58.01,8.84 59.05,7.8 OLED1.2
SCKA: length 28
  Top Layer w0.254: U2.6 67.07,25.44 73.54,18.97 R35.1
SCLK: length 9.8
  Top Layer w0.254: U2.52 46.23,22.59 46.23,21.97 46.65,21.55 47.29,21.55 51.57,17.27 52.2,17.27 52.56,17.64 U10.6
SD0: length 7.8
  Top Layer w0.254: 52.42,18.54 50.81,18.54 47.44,21.91 46.8,21.91 46.61,22.09 U2.53
SD1: length 15.8
  Top Layer w0.254: v1(50.8,19.69) 52.73,19.69 52.74,19.7 53.24,19.7 53.25,19.69 57.16,19.69 U10.2 ; v1(47.5,23.5) 47.41,23.41 U2.55
  Bottom Layer w0.254: v1(50.8,19.69) 49.5,20.98 49.5,21.79 49.22,22.07 48.42,22.07 47.5,22.99 v1(47.5,23.5)
SD2: length 15.3
  Top Layer w0.254: v1(46.86,23.5) 46.86,23.28 46.99,23.15 46.99,22.63 U2.54 ; 58.31,22.63 56,20.32 50.29,20.32 v1(49.02,21.59)
  Bottom Layer w0.254: v1(49.02,21.59) 47.75,21.59 46.99,22.35 46.99,23.37 v1(46.86,23.5)
SD3: length 11.6
  Top Layer w0.254: 54.21,16.74 53.26,16.74 52.99,16.47 52.92,16.47 52.83,16.38 51.95,16.38 47.14,21.19 46.5,21.19 45.83,21.86 45.83,22.5 45.81,22.52 U2.51
SDA: length 25.4
  Top Layer w0.254: v1(47.75,28.58) 47.81,28.64 U2.15
  Bottom Layer w0.254: OLED1.1 59.05,14.35 47.12,26.29 47.12,27.98 47.55,28.42 47.6,28.42 v1(47.75,28.58)
SS: length 16
  Top Layer w0.254: U2.56 47.94,22.48 v1(51.94,22.48) ; v1(60.1,20.83) 60.86,21.59 R26.2 R27.1
  Bottom Layer w0.254: v1(51.94,22.48) 53.59,20.83 v1(60.1,20.83)
SW1: length 55.9
  Top Layer w0.254: R31.2 95.63,33.54 KEY1.3 84.3,34.18 83.02,35.46 79.46,35.46 78.71,34.71 69.28,34.71 68.17,35.81 64.32,35.81 63.36,34.85 63.36,33.64 59.31,29.59 56.52,29.59 v1(56.26,29.34) ; U2.12 47.86,27.83 v1(47.75,27.94)
  Bottom Layer w0.254: v1(47.75,27.94) 51.92,27.94 51.96,27.9 54.82,27.9 v1(56.26,29.34)
SW2: length 40.4
  Top Layer w0.254: R32.2 80.52,33.65 KEY2.3 69.3,34.18 68.02,35.46 64.46,35.46 63.71,34.71 63.71,33.49 59.44,29.21 57.66,29.21 v1(57.4,28.96) ; U2.11 48.62,27.41 48.1,27.41 47.95,27.27 v1(47.62,27.27)
  Bottom Layer w0.254: v1(47.62,27.27) 47.81,27.46 55.06,27.46 56.56,28.96 v1(57.4,28.96)
SW3: length 21.8
  Top Layer w0.254: U2.9 49.44,26.64 49.46,26.61 50.61,26.61 51.67,27.66 57.56,27.66 58.26,28.36 59.17,28.36 KEY3.3 65.53,33.64 R33.2
T0+: length 13.8
  Top Layer w0.254: C15.1 22.84,28.24 D0.14 D0.1 22.84,30.67 23.77,31.61 23.77,32.23 USB IN.A2 ; v2(19.43,34.8) 19.59,34.64 USB IN.B2
  Bottom Layer w0.254: v2(23.62,31.24) 23.35,31.24 22.82,30.71 20.99,30.71 20.68,31.02 20.68,31.46 19.94,32.2 19.94,34.29 v2(19.43,34.8)
T0-: length 13.2
  Top Layer w0.254: USB IN.A3 23.27,32.23 23.27,31.68 22.34,30.75 D0.2 D0.13 22.34,28.07 C16.1 ; v2(20.21,34.8) 20.09,34.68 USB IN.B3
  Bottom Layer w0.254: v2(22.73,31.37) 22.73,32.28 22.81,32.35 22.81,35.04 22.47,35.38 22.14,35.38 21.86,35.66 21.86,35.66 21.78,35.74 21,35.74 20.21,34.94 v2(20.21,34.8)
T1+: length 15.9
  Top Layer w0.254: C67.1 4.98,10.75 D1.14 D1.1 4.98,7.99 4.42,7.44 4.42,6.89 USB1.A2 ; 8.6,5.47 8.6,4.61 v1(9.4,3.81)
  Bottom Layer w0.254: v1(4.83,8.25) 4.95,8.25 5.46,8.76 8.64,8.76 9.33,8.07 9.33,3.88 v1(9.4,3.81)
T1-: length 11.8
  Top Layer w0.254: v1(7.75,4.44) 8.1,4.8 8.1,5.47 ; USB1.A3 4.92,6.89 4.92,7.43 5.48,7.99 D1.2 D1.13 5.48,10.79 C68.1
  Bottom Layer w0.254: v1(7.75,4.44) 7.28,4.44 6.8,3.97 5.78,3.97 5.37,4.38 v1(5.37,7.72)
T2+: length 16.3
  Top Layer w0.254: 30.32,5.47 30.39,5.39 30.39,4.85 30.48,4.76 v1(30.48,3.94) ; USB2.A2 26.07,7.78 v1(26.25,7.97) D2.1 D2.14 26.95,10.72 C10.1
  Bottom Layer w0.254: v1(26.25,7.97) 26.56,7.97 26.79,8.2 27.22,8.2 27.78,8.76 30.52,8.76 31.21,8.07 31.21,7.68 30.76,7.22 30.76,4.78 30.48,4.5 v1(30.48,3.94)
T2-: length 16
  Top Layer w0.254: v1(29.72,4.06) 29.82,4.16 29.82,5.47 ; C11.1 27.45,10.79 D2.13 D2.2 27.45,8.18 v1(26.99,7.72) 26.93,7.72 26.64,7.43 26.64,6.89 USB2.A3
  Bottom Layer w0.254: v1(29.72,4.06) 29.67,4.06 28.83,3.23 25.68,3.23 25.17,3.74 25.17,4.14 25.46,4.42 25.46,5.01 26.99,6.55 v1(26.99,7.72)
T3+: length 6
  Top Layer w0.254: C19.1 45.87,18.37 D3.14 D3.1 43.71,14.12 USB3.9
T3-: length 5.1
  Top Layer w0.254: C18.1 46.37,18.41 D3.13 D3.2 46.37,15.25 USB3.8
TX0+: length 7.4
  Top Layer w0.254: C15.2 22.87,26.92 22.87,26.66 23.05,26.48 26.71,26.48 28.21,24.98 28.28,24.98 U1.55
TX0-: length 7.7
  Top Layer w0.254: C16.2 22.47,26.92 22.47,26.49 22.88,26.08 26.54,26.08 27.93,24.69 27.93,24.62 U1.56
TX1+: length 25.4
  Top Layer w0.254: C67.2 4.7,12.02 5,12.32 5,12.74 5.42,13.16 16.4,13.16 16.91,13.67 20.07,13.67 26.18,19.78
TX1-: length 25.1
  Top Layer w0.254: U1.4 20.37,13.27 17.08,13.27 16.56,12.75 5.59,12.75 5.41,12.57 5.41,12.32 5.71,12.02 C68.2
TX2+: length 6.4
  Top Layer w0.254: 26.67,11.54 26.67,11.98 26.98,12.28 26.98,14.86 28.63,16.51 28.63,16.58 U1.11
TX2-: length 6
  Top Layer w0.254: U1.12 28.99,16.23 28.92,16.23 27.38,14.69 27.38,12.32 27.69,12.02 C11.2
TX3+: length 17.6
  Bottom Layer w0.254: v1(32,16.26) 31.68,16.58 31.68,16.73 31.32,17.1 31.32,17.69 31.63,18 45.72,18 45.9,18.18 45.9,18.44 45.59,18.74 v1(45.59,19.2)
TX3-: length 17.2
  Bottom Layer w0.254: v1(46.61,19.19) 46.61,18.74 46.3,18.43 46.3,18.01 45.89,17.59 31.8,17.59 31.73,17.52 31.73,17.26 31.91,17.08 32.06,17.08 v1(32.39,16.76)
UP_POWER: length 38
  Top Layer w0.254: R10.1 26.56,31.11 C17.1 ; 24.41,35.56 v1(24.51,35.56) ; 24.41,35.56 23.51,35.56 22.97,35.02 22.97,34.58 23.09,34.45 USB IN.B9 ; 24.41,35.56 23.97,36 23.97,36.39 23.69,36.67 19.53,36.67 17.21,34.36 arc(16.69,34.05) 16.39,33.53 9.66,26.8 7.88,26.8 5.59,24.51 SW2.3
  Bottom Layer w0.254: v1(24.51,35.56) 25.15,34.92 26.67,34.92 26.85,34.75 26.85,33.93 arc(27.03,33.59) 27.09,33.22 27.09,32.82 arc(27.03,32.45) 26.85,32.11 v1(26.85,30.99)
XI: length 11.5
  Top Layer w0.254: 17.78,22.82 19.11,22.82 v1(19.68,22.25) 19.68,20.66 C1.1 ; 26.18,22.13 v1(26.59,21.72)
  Bottom Layer w0.254: v1(19.68,22.25) 20.22,21.72 v1(26.59,21.72)
XO: length 13
  Top Layer w0.254: 21.88,23.95 24.1,23.95 24.73,24.58 24.96,24.58 26.1,23.44 26.1,22.91 U1.61 ; 21.88,23.95 21.95,24.02 C2.2 ; 21.88,23.95 21.38,23.95 20.5,24.83 18.86,24.83 18.7,24.67 18.7,24.14 R1.2
$1N3195: length 1.2
  Top Layer w0.254: U1.42 34.5,25.27 R5.1
$1N3221: length 1.1
  Top Layer w0.254: R6.1 35.26,24.62 34.53,23.89
$1N6674: length 5.2
  Top Layer w0.254: R13.1 55.39,6 C21.1 C20.2 55.39,8.94 USB3.10
$1N7398: length 1.1
  Top Layer w0.254: U7.4 10.62,19.31 L1.1
$1N7474: length 2.1
  Top Layer w0.254: U7.1 8.39,20.41 R15.2 R14.2
$1N10571: length 7.3
  Top Layer w0.254: USB3.1 39.32,12.62 39.05,12.89 38.46,12.89 38.29,12.72 38.29,12.53 C41.2 38.23,12.43 L7.2
$1N11667: length 1.1
  Top Layer w0.254: U9.7 16.77,7.87 R17.2
$1N12274: length 1.1
  Top Layer w0.254: R20.2 34.29,8.24 34.17,8.36 34.17,8.77 34.06,8.88
$1N12991: length 1.5
  Top Layer w0.254: USB POWER.A5 11.96,31.56 12.21,31.32 12.28,31.32 R22.1
$1N12995: length 1.5
  Top Layer w0.254: USB POWER.B5 11.35,30.24 R23.2
$1N13220: length 1.4
  Top Layer w0.254: R24.1 44.21,21.69 U2.47
$1N13246: length 1.4
  Top Layer w0.254: U2.46 43.81,21.57 R25.1
$1N13961: length 2.8
  Top Layer w0.254: X2.1 49.6,31.16 R29.1 C51.1
$1N13963: length 2.6
  Top Layer w0.254: X2.3 46.29,33.25 C52.2 R28.2
$1N14103: length 2.5
  Top Layer w0.254: 45.39,29.46 45.39,31.2 R28.1
$1N14108: length 4.9
  Top Layer w0.254: R29.2 49.27,29.98 48.22,29.98 48.03,30.16 46,30.16 45.81,29.98 U2.20
$1N14919: length 21.6
  Top Layer w0.254: RUN.1 44.94,34.65 43.96,34.65 42.17,36.44 42.17,38.08 42.01,38.24 39.78,38.24 39.61,38.08 39.61,36.35 43.17,32.79 R30.2 43.41,30.24 U2.26
$1N15444: length 1.8
  Top Layer w0.254: R34.2 76.02,17.96 U3.3
$1N15470: length 1.8
  Top Layer w0.254: U3.2 76.02,18.97 R35.2
$1N15496: length 1.9
  Top Layer w0.254: U3.4 74.82,16.56 R36.2
$1N16095: length 9.5
  Top Layer w0.254: U2.24 44.2,29.44 v1(44.2,28.58)
  Bottom Layer w0.254: v1(44.2,37.21) v1(44.2,28.58)
$1N16100: length 9
  Top Layer w0.254: U2.25 43.81,34.29 SWD.1
$1N22955: length 1.5
  Top Layer w0.254: R16.2 9.63,24 U6.3
$1N22971: length 1.5
  Top Layer w0.254: R37.2 9.38,14.86 9.69,15.18
$1N23089: length 4.2
  Top Layer w0.254: USB1.2 1.62,2.1 0.74,2.1 0.49,2.35 C30.2 C66.1
$1N23092: length 12.7
  Top Layer w0.254: C69.1 2.52,9.42 L2.1 2.37,7.47 arc(1.48,7.16) 1.11,6.3 1.11,5.9 arc(1.49,5.03) 2.39,4.72 2.55,4.56 2.55,4.27 3.36,3.46 3.65,3.46 3.81,3.3 4.06,3.3 4.73,3.97 5.02,3.97 5.3,4.25 5.3,4.64 5.1,4.85 5.1,5.47
$1N23137: length 5.8
  Top Layer w0.254: USB2.3 32.79,1.57 C8.2 C9.1 32.39,5.95 USB2.4
$1N23140: length 11.9
  Top Layer w0.254: C12.1 23.47,9.29 L3.1 22.99,8.8 22.99,6.89 arc(22.87,6.61) 22.82,6.3 22.82,5.9 arc(23.27,4.97) 24.27,4.75 24.27,4.55 25.35,3.46 25.85,3.46 25.98,3.58 26.61,3.58 26.89,3.87 26.89,4.56 26.75,4.7 26.75,5.39 26.82,5.47
$1N23189: length 11.4
  Top Layer w0.254: 17.53,35.17 17.53,37.42 USB IN.3 ; USB IN.2 26.95,38.46 26.95,38.63 27.11,38.8 27.71,38.8 27.87,38.63 27.87,38.44 C13.2 C14.1 27.96,35.07 USB IN.1

## Copper pours and planes (outline as drawn; the poured copper is in the pictures)
3.3VPI on Inner2: 97.54,-0.25 97.28,-0.51 56.39,-0.51 56.39,11.05 48.61,18.83 43.79,18.83 43.74,30.09 39,30.09 34.54,34.54 34.54,39.24 34.8,38.99 97.15,38.99 97.54,38.61
GND on Top Layer: -0.38,-0.38 -0.38,27.81 -0.25,27.94 0.06,27.94 11.61,39.5 12,39.12 97.54,39.12 97.54,-0.51 97.41,-0.38
GND on Bottom Layer: 0.13,-1.02 -0.38,-0.51 -0.38,29.59 10.29,40.26 11.05,39.5 97.11,39.5 97.79,38.82 97.79,-0.38 97.15,-1.02
GND on Inner1: 97.66,-0.51 97.41,-0.77 -0.26,-0.77 0,-0.51 -0.02,-0.49 -0.02,28.05 10.99,39.06 97.41,39.06 97.66,38.81

## Text on the board
Bottom Silkscreen Layer: Made By Shaurya | Functional Hub
Top Silkscreen Layer: EXTERNAL / POWER | INTERNAL / POWER | Better not mess with me / I might blow up | Functional Hub
